# EAGLE design SmartClock (EAGLE 9.6.1)

## Sheet 1 of 2: Main System
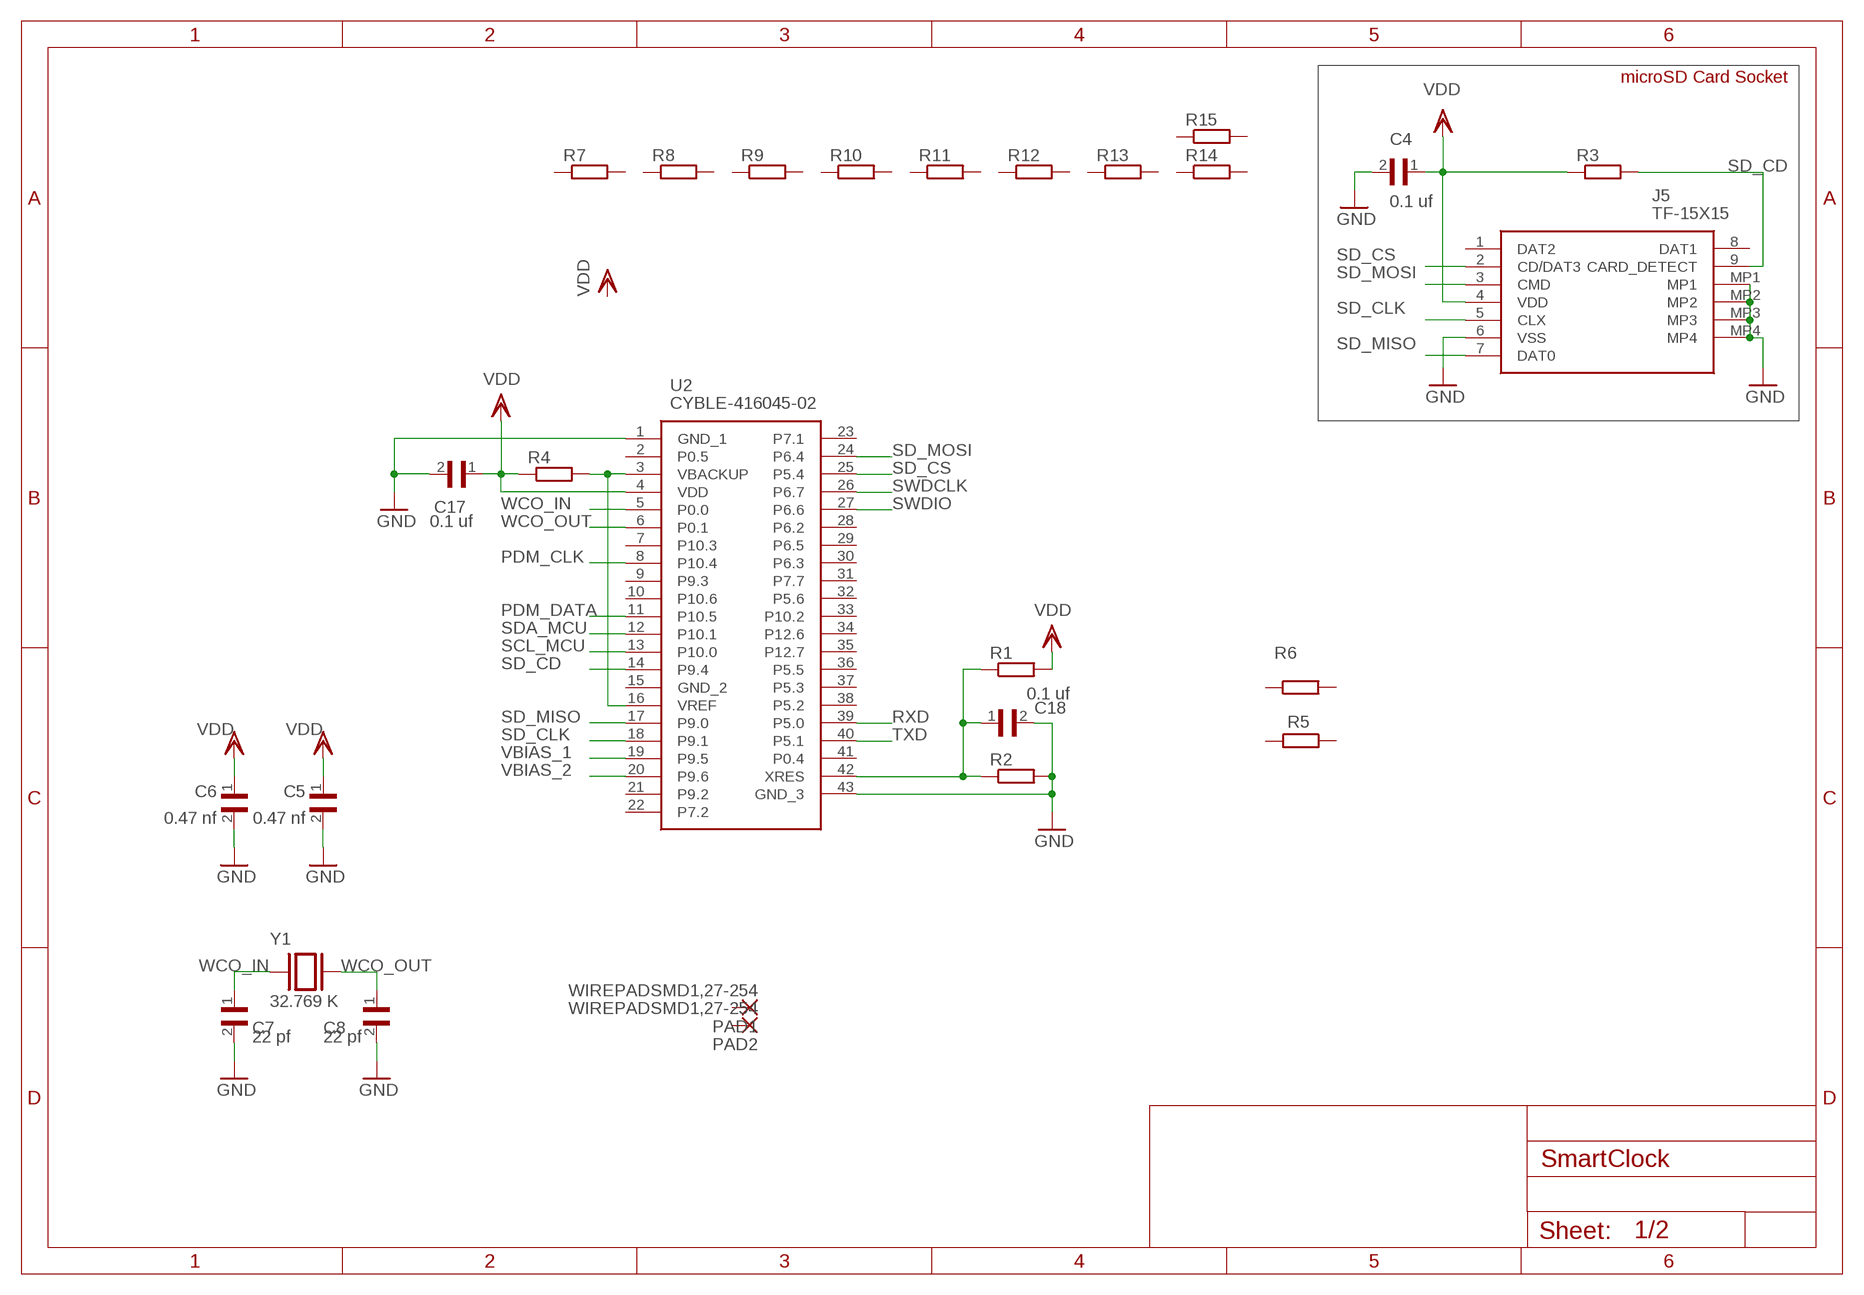
[diagram p0: schematic, sheet 1]

### Parts
C4  0.1 uf  C0603C103K5RAC  [CAPC1608X90]
C5  0.47 nf  C0603C103K5RAC  [CAPC1608X90]
C6  0.47 nf  C0603C103K5RAC  [CAPC1608X90]
C7  22 pf  C0603C103K5RAC  [CAPC1608X90]
C8  22 pf  C0603C103K5RAC  [CAPC1608X90]
C17  0.1 uf  C0603C103K5RAC  [CAPC1608X90]
C18  0.1 uf  C0603C103K5RAC  [CAPC1608X90]
J5  TF-15X15  [TF15X15]
PAD1  WIREPADSMD1,27-254  [SMD1,27-2,54]
PAD2  WIREPADSMD1,27-254  [SMD1,27-2,54]
R1  R-EU_R0603  [R0603]
R2  R-EU_R0603  [R0603]
R3  R-EU_R0603  [R0603]
R4  R-EU_R0603  [R0603]
R5  R-EU_R0603  [R0603]
R6  R-EU_R0603  [R0603]
R7  R-EU_R0603  [R0603]
R8  R-EU_R0603  [R0603]
R9  R-EU_R0603  [R0603]
R10  R-EU_R0603  [R0603]
R11  R-EU_R0603  [R0603]
R12  R-EU_R0603  [R0603]
R13  R-EU_R0603  [R0603]
R14  R-EU_R0603  [R0603]
R15  R-EU_R0603  [R0603]
U2  CYBLE-416045-02  [CYBLE41604502]
Y1  32.769 K  MS3V-T1R  [XTAL_MS3V-T1R]

### Nets
GND: C4.2 C5.2 C6.2 C7.2 C8.2 C17.2 C18.2 J5.6(VSS) J5.MP1 J5.MP2 J5.MP3 J5.MP4 R2.2 U2.1(GND_1) U2.43(GND_3)
N$1: R4.2 U2.3(VBACKUP) U2.16(VREF)
N$9: C18.1 R1.1 R2.1 U2.42(XRES)
PDM_CLK: U2.8(P10.4)
PDM_DATA: U2.11(P10.5)
RXD: U2.39(P5.0)
SCL_MCU: U2.13(P10.0)
SD_CD: J5.9(CARD_DETECT) R3.2 U2.14(P9.4)
SD_CLK: J5.5(CLX) U2.18(P9.1)
SD_CS: J5.2(CD/DAT3) U2.25(P5.4)
SD_MISO: J5.7(DAT0) U2.17(P9.0)
SD_MOSI: J5.3(CMD) U2.24(P6.4)
SDA_MCU: U2.12(P10.1)
SWDCLK: U2.26(P6.7)
SWDIO: U2.27(P6.6)
TXD: U2.40(P5.1)
VBIAS_1: U2.19(P9.5)
VBIAS_2: U2.20(P9.6)
VDD: C4.1 C5.1 C6.1 C17.1 J5.4(VDD) R1.2 R3.1 R4.1 U2.4(VDD)
WCO_IN: C7.1 U2.5(P0.0) Y1.1
WCO_OUT: C8.1 U2.6(P0.1) Y1.2
Unconnected: J5.1(DAT2) J5.8(DAT1) PAD1.1(P) PAD2.1(P) R5.1 R5.2 R6.1 R6.2 R7.1 R7.2 R8.1 R8.2 R9.1 R9.2 R10.1 R10.2 R11.1 R11.2 R12.1 R12.2 R13.1 R13.2 R14.1 R14.2 R15.1 R15.2 U2.2(P0.5) U2.7(P10.3) U2.9(P9.3) U2.10(P10.6) U2.15(GND_2) U2.21(P9.2) U2.22(P7.2) U2.23(P7.1) U2.28(P6.2) U2.29(P6.5) U2.30(P6.3) U2.31(P7.7) U2.32(P5.6) U2.33(P10.2) U2.34(P12.6) U2.35(P12.7) U2.36(P5.5) U2.37(P5.3) U2.38(P5.2) U2.41(P0.4)

### Notes on the sheet
- microSD Card Socket

## Sheet 2 of 2: HMI, Sensor and Audio
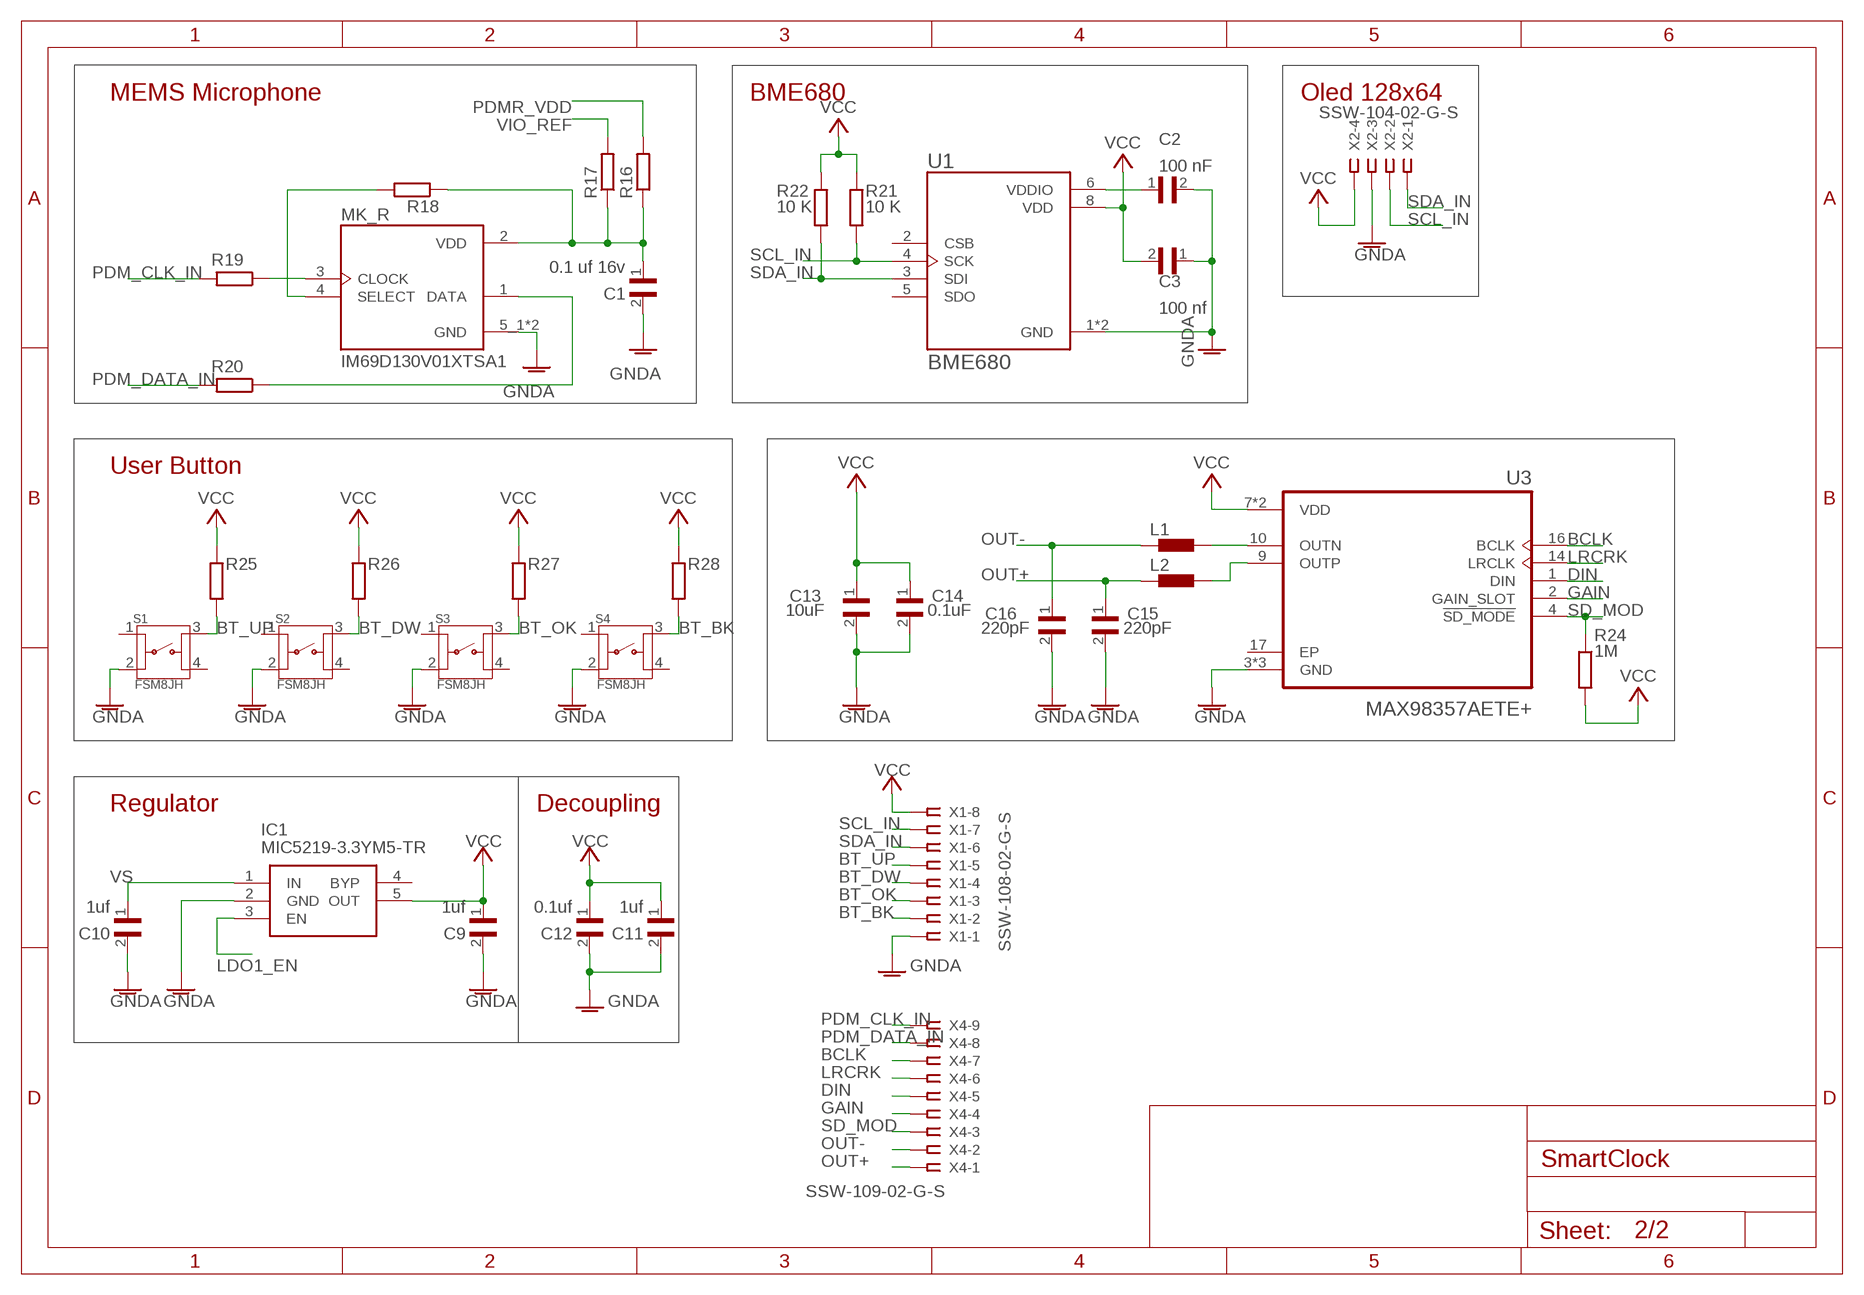
[diagram p1: schematic, sheet 2]

### Parts
C1  0.1 uf 16v  C0603C103K5RAC  [CAPC1608X90]
C2  100 nF  C0603C103K5RAC  [CAPC1608X90]
C3  100 nf  C0603C103K5RAC  [CAPC1608X90]
C9  1uf  C0603C103K5RAC  [CAPC1608X90]
C10  1uf  C0603C103K5RAC  [CAPC1608X90]
C11  1uf  C0603C103K5RAC  [CAPC1608X90]
C12  0.1uf  C0603C103K5RAC  [CAPC1608X90]
C13  10uF  C0603C103K5RAC  [CAPC1608X90]
C14  0.1uF  C0603C103K5RAC  [CAPC1608X90]
C15  220pF  C0603C103K5RAC  [CAPC1608X90]
C16  220pF  C0603C103K5RAC  [CAPC1608X90]
IC1  MIC5219-3.3YM5-TR  [SOT95P280X145-5N]
L1  BLM15HB121SN1  [0402]
L2  BLM15HB121SN1  [0402]
MK_R  IM69D130V01XTSA1  [MIC_IM69D130V01XTSA1]
R16  R-EU_R0603  [R0603]
R17  R-EU_R0603  [R0603]
R18  R-EU_R0603  [R0603]
R19  R-EU_R0603  [R0603]
R20  R-EU_R0603  [R0603]
R21  10 K  R-EU_R0603  [R0603]
R22  10 K  R-EU_R0603  [R0603]
R24  1M  R-EU_R0603  [R0603]
R25  R-EU_R0603  [R0603]
R26  R-EU_R0603  [R0603]
R27  R-EU_R0603  [R0603]
R28  R-EU_R0603  [R0603]
S1  FSM8JH  [SW_FSM8JH]
S2  FSM8JH  [SW_FSM8JH]
S3  FSM8JH  [SW_FSM8JH]
S4  FSM8JH  [SW_FSM8JH]
U1  BME680  [PSON80P300X300X100-8N]
U3  MAX98357AETE+  [QFN50P300X300X80-17N]
X1  SSW-108-02-G-S  [SSW-108-02-G-S]
X2  SSW-104-02-G-S  [SSW-104-02-G-S]
X4  SSW-109-02-G-S  [SSW-109-02-G-S]

### Nets
BCLK: U3.16(BCLK) X4.7
BT_BK: R28.2 S4.3 X1.2
BT_DW: R26.2 S2.3 X1.4
BT_OK: R27.2 S3.3 X1.3
BT_UP: R25.2 S1.3 X1.5
DIN: U3.1(DIN) X4.5
GAIN: U3.2(GAIN_SLOT) X4.4
GNDA: C1.2 C2.2 C3.1 C9.2 C10.2 C11.2 C12.2 C13.2 C14.2 C15.2 C16.2 IC1.2(GND) MK_R.5_1(GND) MK_R.5_2(GND) S1.2 S2.2 S3.2 S4.2 U1.1(GND) U1.7(GND) U3.3(GND) U3.11(GND) U3.15(GND) X1.1 X2.3
LDO1_EN: IC1.3(EN)
LRCRK: U3.14(LRCLK) X4.6
N$2: MK_R.3(CLOCK) R19.1
N$3: MK_R.4(SELECT) R18.2
N$4: C1.1 MK_R.2(VDD) R16.1 R17.1 R18.1
N$5: MK_R.1(DATA) R20.1
N$7: C2.1 U1.6(VDDIO)
N$11: L1.2 U3.10(OUTN)
N$12: L2.2 U3.9(OUTP)
OUT+: C15.1 L2.1 X4.1
OUT-: C16.1 L1.1 X4.2
PDM_CLK_IN: R19.2 X4.9
PDM_DATA_IN: R20.2 X4.8
PDMR_VDD: R16.2
SCL_IN: R21.2 U1.4(SCK) X1.7 X2.2
SD_MOD: R24.1 U3.4(!SD_MODE) X4.3
SDA_IN: R22.2 U1.3(SDI) X1.6 X2.1
VCC: C3.2 C9.1 C11.1 C12.1 C13.1 C14.1 IC1.5(OUT) R21.1 R22.1 R24.2 R25.1 R26.1 R27.1 R28.1 U1.8(VDD) U3.7(VDD) U3.8(VDD) X1.8 X2.4
VIO_REF: R17.2
VS: C10.1 IC1.1(IN)
Unconnected: IC1.4(BYP) S1.1 S1.4 S2.1 S2.4 S3.1 S3.4 S4.1 S4.4 U1.2(CSB) U1.5(SDO)

### Notes on the sheet
- MEMS Microphone | BME680 | Oled 128x64
- User Button
- Regulator | Decoupling

## Power pins joined to a net without a drawn wire
EP: U3.17(EP)

## Library data of the parts
C1-C18 = C0603C103K5RAC:C0603C103K5RAC: C0603C103K5RAC7867 Cap 0.01uF 50VDC X7R 10% SMD 0603 Paper Check availability <https://pricing.snapeda.com/parts/C0603C103K5RAC/KEMET/view-part?ref=eda>; AVAILABILITY: In Stock; CHECK_PRICES: https://www.snapeda.com/parts/C0603C103K5RAC/KEMET/view-part/?ref=eda; DESCRIPTION: 10000 pF ±10% 50V Ceramic Capacitor X7R 0603 (1608 Metric); MF: KEMET; MP: C0603C103K5RAC; PACKAGE: 0603 KEMET; PRICE: None; SNAPEDA_LINK: https://www.snapeda.com/parts/C0603C103K5RAC/KEMET/view-part/?ref=snap
IC1 = MIC5219-3.3YM5-TR:MIC5219-3.3YM5-TR: LDO Regulator Pos 3.3V 0.5A Microchip MIC5219-3.3YM5-TR, LDO Voltage Regulator, 500mA, 3.3 V +/-2%, 2.5 12 Vin, 5-Pin SOT-23 Source: Datasheet <http://www.microchip.com/mymicrochip/filehandler.aspx?ddocname=en579712>; ARROW_PART_NUMBER: MIC5219-3.3YM5-TR; ARROW_PRICE-STOCK: https://www.arrow.com/en/products/mic5219-3.3ym5-tr/microchip-technology?region=nac; DESCRIPTION: LDO Regulator Pos 3.3V 0.5A Microchip MIC5219-3.3YM5-TR, LDO Voltage Regulator, 500mA, 3.3 V +/-2%, 2.5 12 Vin, 5-Pin SOT-23; HEIGHT: 1.45mm; MANUFACTURER_NAME: Microchip; MANUFACTURER_PART_NUMBER: MIC5219-3.3YM5-TR; MOUSER_PART_NUMBER: 998-MIC5219-3.3YM5TR; MOUSER_PRICE-STOCK: https://www.mouser.co.uk/ProductDetail/Microchip-Technology/MIC5219-3.3YM5-TR?qs=U6T8BxXiZAWojkIJMtSJlw%3D%3D
J5 = TF-15X15:TF-15X15: Micro-SD Card Socket Source: Datasheet <https://datasheet.lcsc.com/szlcsc/SOFNG-TF-15-15_C111196.pdf>; DESCRIPTION: Micro-SD Card Socket; HEIGHT: 1.85mm; MANUFACTURER_NAME: SOFNG; MANUFACTURER_PART_NUMBER: TF-15X15
L1 L2 = inductors:BLM15H: EMIFIL (R) Chip Ferrite Bead for GHz Noise Source: http://www.murata.com/ Ferrite Bead BLM15H.pdf
MK_R = IM69D130V01XTSA1:IM69D130V01XTSA1: Check availability <https://pricing.snapeda.com/parts/IM69D130V01XTSA1/Infineon%20Technologies/view-part?ref=eda>; AVAILABILITY: In Stock; CHECK_PRICES: https://www.snapeda.com/parts/IM69D130V01XTSA1/Infineon+Technologies/view-part/?ref=eda; DESCRIPTION: 69 dB(A) signal-to-noise ratio | Below 1 percent distortions at 128 dBSPL (AOP - 130 dBSPL) | Digital (PDM) interface with 6 ?s group delay at 1 kHz | Tight sensitivity (-36 1 dB) and phase ( 2 deg) tolerances; MF: Infineon Technologies; MP: IM69D130V01XTSA1; PACKAGE: None; PRICE: None; PURCHASE-URL: https://www.snapeda.com/api/url_track_click_mouser/?unipart_id=2689823&manufacturer=Infineon Technologies&part_name=IM69D130V01XTSA1&search_term=im69d130; SNAPEDA_LINK: https://www.snapeda.com/parts/IM69D130V01XTSA1/Infineon+Technologies/view-part/?ref=snap
PAD1 PAD2 = wirepad:WIREPAD: Wire PAD connect wire on PCB
R1-R22 R24-R28 = rcl:R-EU_: RESISTOR, European symbol; SPICEPREFIX: R
S1-S4 = FSM8JH:FSM8JH: Switch, Pushbutton, Tactile, SPST, Thru Hole, Vertical, 6MM, Black Check availability <https://pricing.snapeda.com/parts/FSM8JH/TE%20Connectivity/view-part?ref=eda>; AVAILABILITY: In Stock; CHECK_PRICES: https://www.snapeda.com/parts/FSM8JH/TE+Connectivity+ALCOSWITCH+Switches/view-part/?ref=eda; DESCRIPTION: Switch,Pushbutton,Tactile,SPST,Thru Hole,Vertical,6MM,Black | TE Connectivity FSM8JH; MF: TE Connectivity; MP: FSM8JH; PACKAGE: None; PRICE: None; SNAPEDA_LINK: https://www.snapeda.com/parts/FSM8JH/TE+Connectivity+ALCOSWITCH+Switches/view-part/?ref=snap
U1 = BME680:BME680: Integrated Environmental Unit Check availability <https://pricing.snapeda.com/parts/BME680/Bosch%20Sensortec/view-part?ref=eda>; AVAILABILITY: In Stock; CHECK_PRICES: https://www.snapeda.com/parts/BME680/Bosch+Sensortec/view-part/?ref=eda; DESCRIPTION: Gas, Humidity, Pressure, Temperature Sensor I2C, SPI Output; MF: Bosch Sensortec; MP: BME680; PACKAGE: LGA-8 Bosch Tools; PRICE: None; SNAPEDA_LINK: https://www.snapeda.com/parts/BME680/Bosch+Sensortec/view-part/?ref=snap
U2 = SamacSys_Parts:CYBLE-416045-02: Bluetooth Bluetooth v5.0 Transceiver Module 2.4GHz ~ 2.5GHz Integrated, Trace Surface Mount Source: Datasheet <https://www.infineon.com/dgdl/Infineon-CYBLE-416045-02-DataSheet-v02_00-EN.pdf?fileId=8ac78c8c7d0d8da4017d0ee63f136e57>; ARROW_PART_NUMBER: CYBLE-416045-02; ARROW_PRICE-STOCK: https://www.arrow.com/en/products/cyble-416045-02/infineon-technologies-ag?region=nac; DESCRIPTION: Bluetooth Bluetooth v5.0 Transceiver Module 2.4GHz ~ 2.5GHz Integrated, Trace Surface Mount; HEIGHT: 2mm; MANUFACTURER_NAME: Infineon; MANUFACTURER_PART_NUMBER: CYBLE-416045-02; MOUSER_PART_NUMBER: 727-CYBLE-416045-02; MOUSER_PRICE-STOCK: https://www.mouser.co.uk/ProductDetail/Infineon-Technologies/CYBLE-416045-02?qs=qSfuJ%252Bfl%2Fd4tWEquEtT6oQ%3D%3D
U3 = MAX98357AETE_:MAX98357AETE+: Audio Amp Speaker 1-CH Mono Class-D 16-Pin TQFN EP Check availability <https://pricing.snapeda.com/parts/MAX98357AETE%2B/Analog%20Devices/view-part?ref=eda>; AVAILABILITY: In Stock; CHECK_PRICES: https://www.snapeda.com/parts/MAX98357AETE+/Analog+Devices/view-part/?ref=eda; DESCRIPTION: Tiny, Low-Cost, PCM Class D Amplifier with Class AB Performance; MF: Analog Devices; MP: MAX98357AETE+; PACKAGE: TQFN-16 Maxim; PRICE: None; PURCHASE-URL: https://www.snapeda.com/api/url_track_click_mouser/?unipart_id=229145&manufacturer=Analog Devices&part_name=MAX98357AETE+&search_term=max98357; SNAPEDA_LINK: https://www.snapeda.com/parts/MAX98357AETE+/Analog+Devices/view-part/?ref=snap
X1 = con-samtec:SSW-108-02-G-S: THROUGH-HOLE .025" SQ POST SOCKET Source: Samtec SSW.pdf; MF: Samtec Inc.; MPN: SSW-108-02-G-S; OC_FARNELL: unknown; OC_NEWARK: 11P9448
X2 = con-samtec:SSW-104-02-G-S: THROUGH-HOLE .025" SQ POST SOCKET Source: Samtec SSW.pdf; MF: Samtec Inc.; MPN: SSW-104-02-G-S; OC_FARNELL: unknown; OC_NEWARK: 11P9384
X4 = con-samtec:SSW-109-02-G-S: THROUGH-HOLE .025" SQ POST SOCKET Source: Samtec SSW.pdf; MF: Samtec Inc.; MPN: SSW-109-02-G-S; OC_FARNELL: unknown; OC_NEWARK: 11P9465
Y1 = MS3V-T1R:MS3V-T1R: Tuning Fork Crystal 30-200 kHz in 1.4 x 1.4 x 6.7 package Check availability <https://pricing.snapeda.com/parts/MS3V-T1R/Micro%20Crystal/view-part?ref=eda>; AVAILABILITY: Not in stock; CHECK_PRICES: https://www.snapeda.com/parts/MS3V-T1R/Micro+Crystal/view-part/?ref=eda; DESCRIPTION: Tuning Fork Crystal 30-200 kHz in 1.4 x 1.4 x 6.7 surface mounted package; MF: Micro Crystal; MP: MS3V-T1R; PACKAGE: SMD-3 Micro Crystal; PRICE: None; PURCHASE-URL: https://www.snapeda.com/api/url_track_click_mouser/?unipart_id=5852304&manufacturer=Micro Crystal&part_name=MS3V-T1R&search_term=ms3v-t1r; SNAPEDA_LINK: https://www.snapeda.com/parts/MS3V-T1R/Micro+Crystal/view-part/?ref=snap

## Board
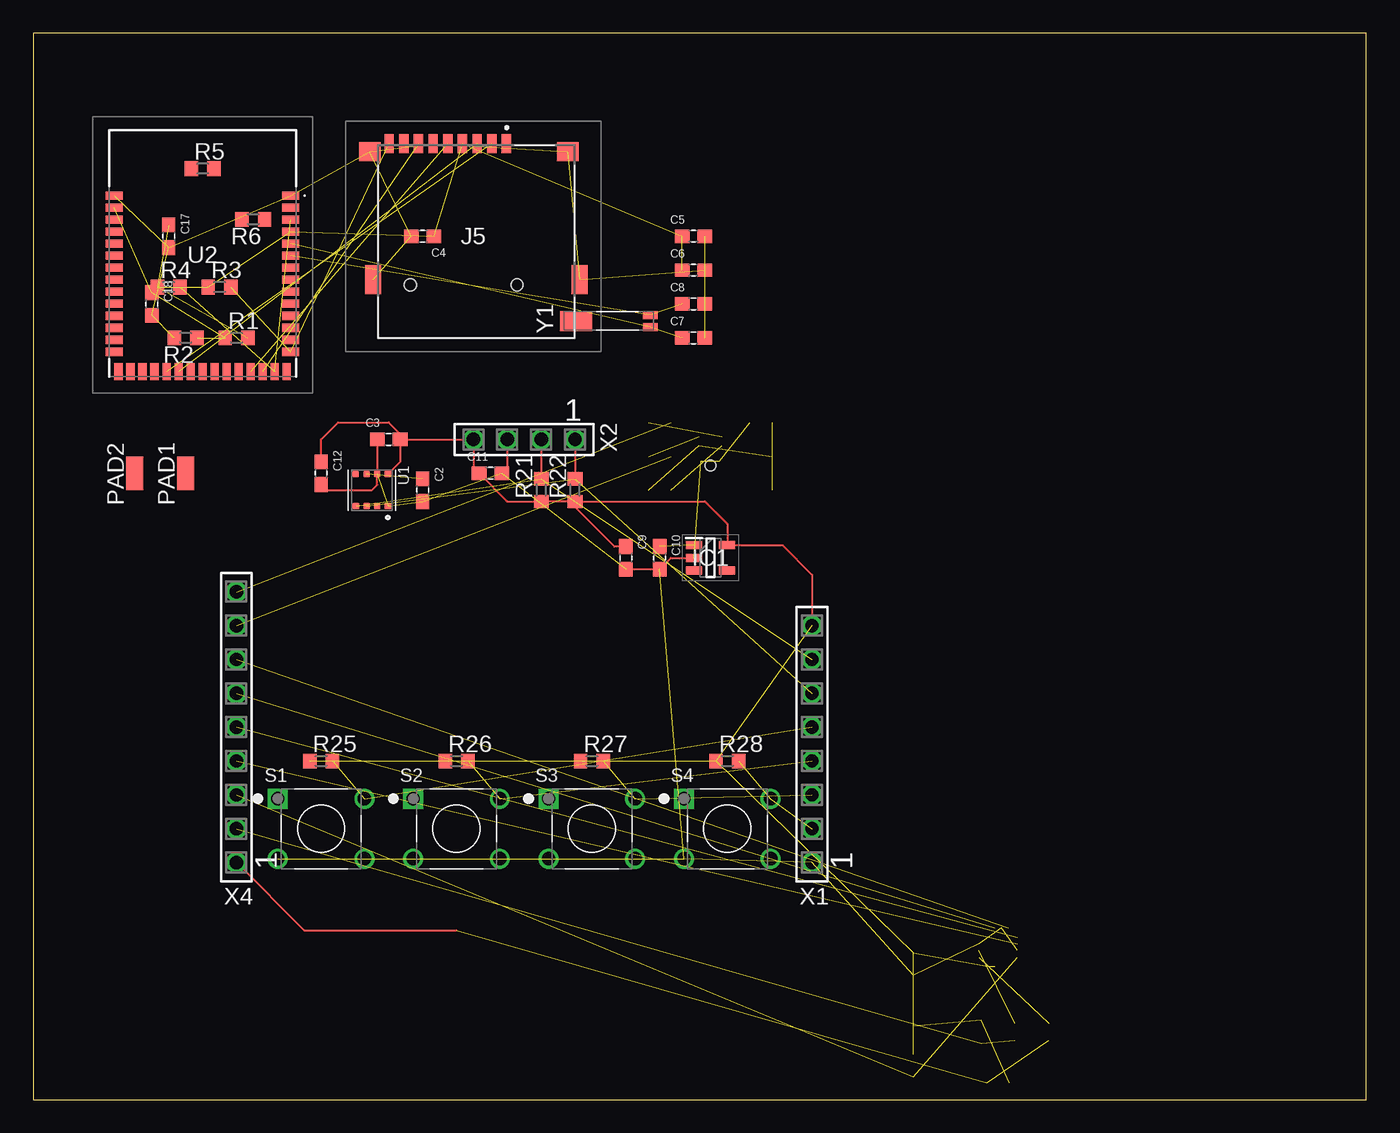
[diagram p2: board, top side]
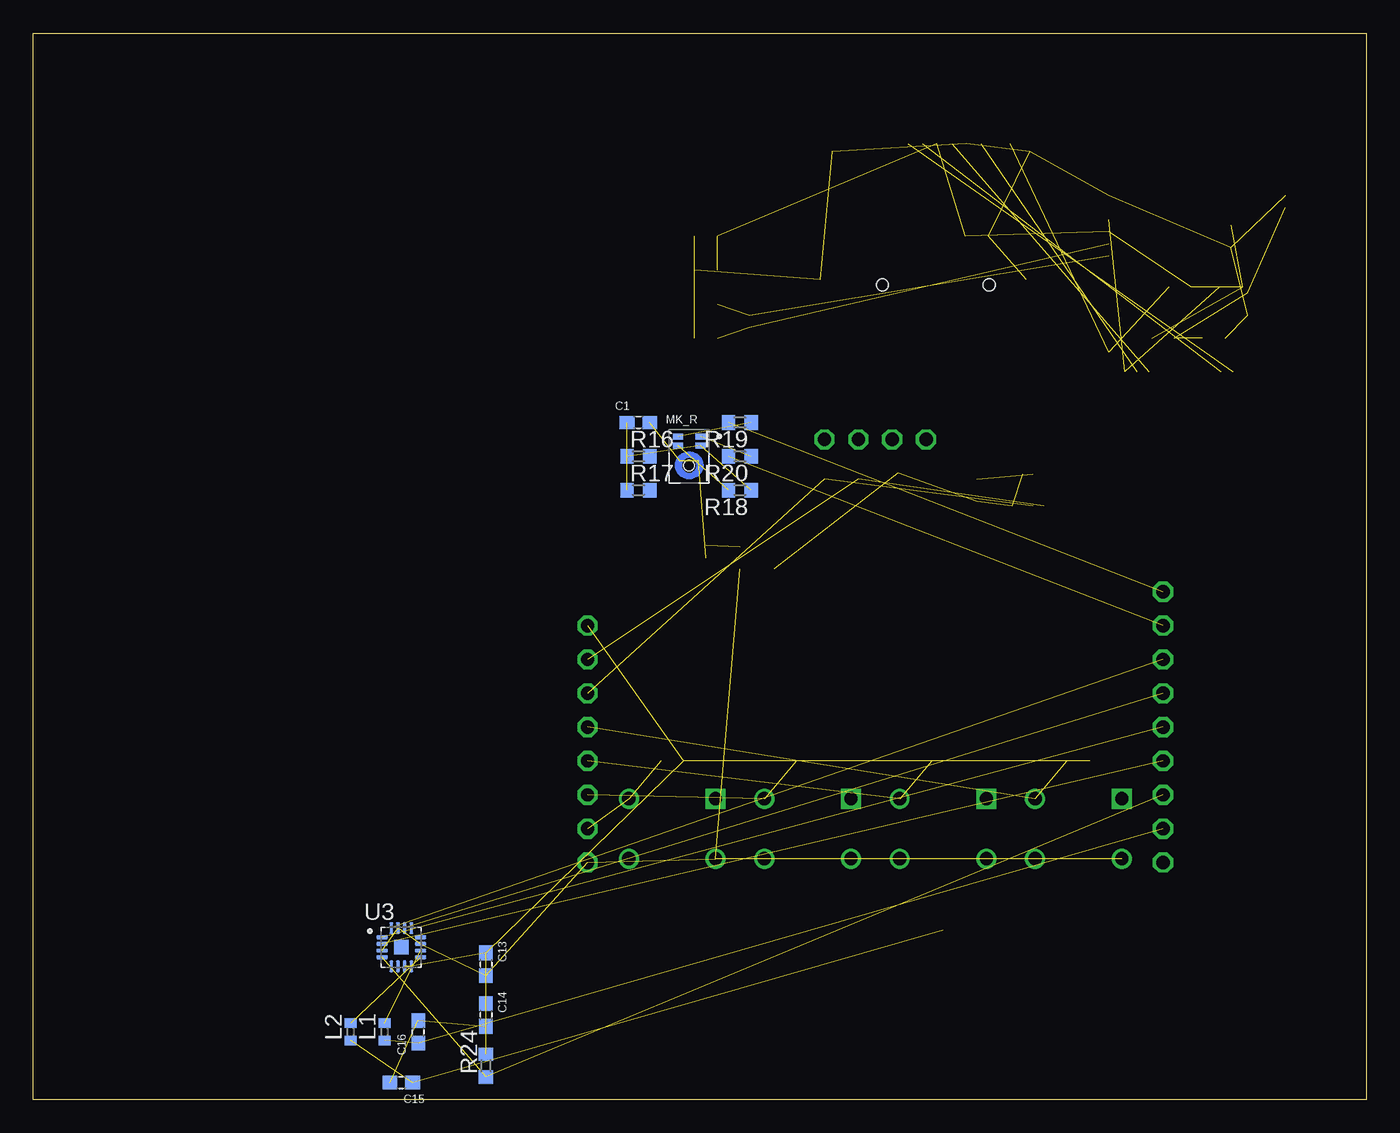
[diagram p3: board, bottom side, seen from below]

Size 100 x 80 mm. Coordinates in mm from the lower left corner, seen from the top.
Outline: 0,0 100,0 100,80 0,80 0,0
Copper layers (1*16): Top 0.035mm / dielectric 1.5mm / Bottom 0.035mm
Design rules "default": minimum track width 6mil, minimum drill 0.35mm, track to track 6mil, track to pad 6mil, pad to pad 6mil, via to via 6mil, smd to smd 6mil, copper to edge 40mil, drill to drill 6mil, minimum pad ring 10mil, minimum via ring 8mil, stop-mask expansion 4mil, vias tented up to drill 0mil, thermal gap 10mil

### Footprints (pad centres in the part's own frame; a part is rotated, then mirrored left to right if it is on the bottom)
CAPC1608X90 = smd 1.1 x 1: 1 -0.85,0; 2 0.85,0
SOT95P280X145-5N = smd 1.2 x 0.6: 1 -1.25,0.95; 2 -1.25,0; 3 -1.25,-0.95; 4 1.25,-0.95; 5 1.25,0.95
TF15X15 = smd 0.7 x 1.4: 1 2.475,6.95; 2 1.375,6.95; 3 0.275,6.95; 4 -0.825,6.95; 5 -1.925,6.95; 6 -3.025,6.95; 7 -4.125,6.95; 8 -5.225,6.95; 9 -6.325,6.95 | smd 1.6 x 1.4: MP1 -7.775,6.35; MP2 7.075,6.35 | smd 1.2 x 2.2: MP3 -7.525,-3.25; MP4 7.975,-3.25 | hole 0.9: -4.725,-3.65; 3.275,-3.65
0402 = smd 0.7 x 0.9: 1 -0.65,0; 2 0.65,0
MIC_IM69D130V01XTSA1 = smd 0.75 x 0.45: 1 0.85,1.5; 2 0.85,0.8; 3 -0.85,1.5; 4 -0.85,0.8 | smd 0.1 x 0.1: 5_1 -0.695,-0.345; 5_2 0.705,-0.345 | hole 0.8: 0,-0.68
SMD1,27-2,54 = smd 1.27 x 2.54: 1 0,0
R0603 = smd 1 x 1.1: 1 -0.85,0; 2 0.85,0
SW_FSM8JH = drill 0.99 square: 1 -3.25,2.25 | drill 0.99: 2 -3.25,-2.25; 3 3.25,2.25; 4 3.25,-2.25
PSON80P300X300X100-8N = smd 0.5 x 0.5: 1 1.2,1.2; 2 1.2,0.4; 3 1.2,-0.4; 4 1.2,-1.2; 5 -1.2,-1.22; 6 -1.2,-0.4; 7 -1.2,0.4; 8 -1.2,1.2
CYBLE41604502 = smd 1.27 x 0.61: 1 6.619,4.32; 2 6.619,3.42; 3 6.619,2.52; 4 6.619,1.62; 5 6.619,0.71; 6 6.619,-0.19; 7 6.619,-1.09; 8 6.619,-1.99; 9 6.619,-2.89; 10 6.619,-3.79; 11 6.619,-4.7; 12 6.619,-5.6; 13 6.619,-6.5; 14 6.619,-7.4; 30 -6.619,-7.4; 31 -6.619,-6.5; 32 -6.619,-5.6; 33 -6.619,-4.7; 34 -6.619,-3.79; 35 -6.619,-2.89; 36 -6.619,-1.99; 37 -6.619,-1.09; 38 -6.619,-0.19; 39 -6.619,0.71; 40 -6.619,1.62; 41 -6.619,2.52; 42 -6.619,3.42; 43 -6.619,4.32 | smd 0.61 x 1.27: 15 6.31,-8.869; 16 5.41,-8.869; 17 4.51,-8.869; 18 3.61,-8.869; 19 2.71,-8.869; 20 1.8,-8.869; 21 0.9,-8.869; 22 0,-8.869; 23 -0.9,-8.869; 24 -1.8,-8.869; 25 -2.7,-8.869; 26 -3.61,-8.869; 27 -4.51,-8.869; 28 -5.41,-8.869; 29 -6.31,-8.869
QFN50P300X300X80-17N = smd 0.86 x 0.27: 1 -1.435,0.75; 2 -1.435,0.25; 3 -1.435,-0.25; 4 -1.435,-0.75; 9 1.435,-0.75; 10 1.435,-0.25; 11 1.435,0.25; 12 1.435,0.75 | smd 0.27 x 0.86: 5 -0.75,-1.435; 6 -0.25,-1.435; 7 0.25,-1.435; 8 0.75,-1.435; 13 0.75,1.435; 14 0.25,1.435; 15 -0.25,1.435; 16 -0.75,1.435 | smd 1.1 x 1.1: 17 0,0
SSW-108-02-G-S = drill 1 pad 1.5 octagon: 1 -8.89,0; 2 -6.35,0; 3 -3.81,0; 4 -1.27,0; 5 1.27,0; 6 3.81,0; 7 6.35,0; 8 8.89,0
SSW-104-02-G-S = drill 1 pad 1.5 octagon: 1 -3.81,0; 2 -1.27,0; 3 1.27,0; 4 3.81,0
SSW-109-02-G-S = drill 1 pad 1.5 octagon: 1 -10.16,0; 2 -7.62,0; 3 -5.08,0; 4 -2.54,0; 5 0,0; 6 2.54,0; 7 5.08,0; 8 7.62,0; 9 10.16,0
XTAL_MS3V-T1R = smd 0.6 x 1.1: 1 -0.45,-3.1; 2 0.45,-3.1 | smd 1.5 x 2.4: S1 0,2.45

### Placement (x,y rotation side)
C1  54.61,50.8 0 bottom
C2  29.21,45.72 270 top
C3  26.67,49.53 0 top
C4  29.21,64.77 180 top
C5  49.53,64.77 0 top
C6  49.53,62.23 0 top
C7  49.53,57.15 0 top
C8  49.53,59.69 0 top
C9  44.45,40.64 270 top
C10  46.99,40.64 270 top
C11  34.29,46.99 0 top
C12  21.59,46.99 270 top
C13  66.04,10.16 270 bottom
C14  66.04,6.35 270 bottom
C15  72.39,1.27 180 bottom
C16  71.12,5.08 90 bottom
C17  10.16,64.77 270 top
C18  8.89,59.69 270 top
IC1  50.8,40.64 0 top
J5  33.02,64.77 0 top
L1  73.66,5.08 90 bottom
L2  76.2,5.08 90 bottom
MK_R  50.8,48.26 0 bottom
PAD1  11.43,46.99 0 top
PAD2  7.62,46.99 0 top
R1  15.24,57.15 0 top
R2  11.43,57.15 180 top
R3  13.97,60.96 0 top
R4  10.16,60.96 0 top
R5  12.7,69.85 0 top
R6  16.51,66.04 180 top
R7  -5.08,-25.4 0 top  (outside the outline)
R8  -5.08,-29.21 0 top  (outside the outline)
R9  -5.08,-33.02 0 top  (outside the outline)
R10  -5.08,-36.83 0 top  (outside the outline)
R11  -5.08,-40.64 0 top  (outside the outline)
R12  -5.08,-44.45 0 top  (outside the outline)
R13  -5.08,-48.26 0 top  (outside the outline)
R14  -5.08,-52.07 0 top  (outside the outline)
R15  -5.08,-55.88 0 top  (outside the outline)
R16  54.61,48.26 0 bottom
R17  54.61,45.72 0 bottom
R18  46.99,45.72 180 bottom
R19  46.99,50.8 180 bottom
R20  46.99,48.26 180 bottom
R21  38.1,45.72 90 top
R22  40.64,45.72 90 top
R24  66.04,2.54 90 bottom
R25  21.59,25.4 0 top
R26  31.75,25.4 0 top
R27  41.91,25.4 0 top
R28  52.07,25.4 0 top
S1  21.59,20.32 0 top
S2  31.75,20.32 0 top
S3  41.91,20.32 0 top
S4  52.07,20.32 0 top
U1  25.4,45.72 270 top
U2  12.7,63.5 0 top
U3  72.39,11.43 0 bottom
X1  58.42,26.67 90 top
X2  36.83,49.53 180 top
X4  15.24,27.94 90 top
Y1  43.18,58.42 90 top

### Tracks (layer width: path | path; a pad name or v marks a point on that pad's centre or on a via)
BCLK  (1 unrouted)
BT_BK  (2 unrouted)
BT_DW  (2 unrouted)
BT_OK  (2 unrouted)
BT_UP  (2 unrouted)
DIN  (1 unrouted)
GAIN  (1 unrouted)
GND  (14 unrouted)
GNDA  (19 unrouted)
  Top 0.152: X2.3 35.56,47.41 C11.2 | C3.1 25.8,49.51 U1.7 25.8,46.12 25.4,45.72 22.01,45.72 C12.2 | C9.2 C10.2 47.84,40.64 IC1.2
LRCRK  (1 unrouted)
N$1  (2 unrouted)
N$2  (1 unrouted)
N$3  (1 unrouted)
N$4  (4 unrouted)
N$5  (1 unrouted)
N$7  (1 unrouted)
N$9  (3 unrouted)
N$11  (1 unrouted)
N$12  (1 unrouted)
OUT+  (2 unrouted)
  Top 0.152: X4.1 20.32,12.7 31.75,12.7
OUT-  (2 unrouted)
PDM_CLK_IN  (1 unrouted)
PDM_DATA_IN  (1 unrouted)
SCL_IN  (2 unrouted)
  Top 0.152: X2.2 R21.2
SD_CD  (2 unrouted)
SD_CLK  (1 unrouted)
SD_CS  (1 unrouted)
SD_MISO  (1 unrouted)
SD_MOD  (2 unrouted)
SD_MOSI  (1 unrouted)
SDA_IN  (2 unrouted)
  Top 0.152: X2.1 R22.2
VCC  (9 unrouted)
  Top 0.152: IC1.5 52.07,41.59 | 52.07,41.59 56.2,41.59 58.42,39.37 X1.8 | R22.1 R21.1 35.56,44.87 C11.1 33.02,47.41 X2.4 C3.2 | R22.1 50.38,44.87 52.07,43.18 52.07,41.59 | C3.2 27.52,47.84 U1.8 | C12.1 21.59,49.53 22.86,50.8 26.67,50.8 27.52,49.95 C3.2 | C9.1 43.6,41.49 40.64,44.45 R22.1
VDD  (8 unrouted)
VS  (1 unrouted)
WCO_IN  (2 unrouted)
WCO_OUT  (2 unrouted)